# Altium schematic sheet AM437x_GP_EVM_PMconnect.SchDoc
size A
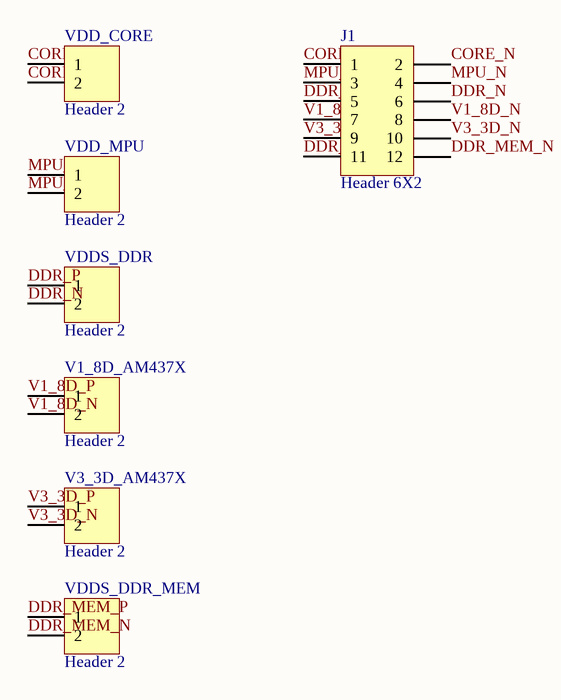
[diagram p0: AM437x_GP_EVM_PMconnect.SchDoc]

## Parts
J1  Header 6X2  [HDR2X6]
V1_8D_AM437X  Header 2  [HDR1X2]
V3_3D_AM437X  Header 2  [HDR1X2]
VDD_CORE  Header 2  [HDR1X2]
VDD_MPU  Header 2  [HDR1X2]
VDDS_DDR  Header 2  [HDR1X2]
VDDS_DDR_MEM  Header 2  [HDR1X2]

## Nets
CORE_N: J1.2 VDD_CORE.2
CORE_P: J1.1 VDD_CORE.1
DDR_MEM_N: J1.12 VDDS_DDR_MEM.2
DDR_MEM_P: J1.11 VDDS_DDR_MEM.1
DDR_N: J1.6 VDDS_DDR.2
DDR_P: J1.5 VDDS_DDR.1
MPU_N: J1.4 VDD_MPU.2
MPU_P: J1.3 VDD_MPU.1
V1_8D_N: J1.8 V1_8D_AM437X.2
V1_8D_P: J1.7 V1_8D_AM437X.1
V3_3D_N: J1.10 V3_3D_AM437X.2
V3_3D_P: J1.9 V3_3D_AM437X.1

## Library data of the parts
J1 = Header 6X2: Header, 6-Pin, Dual row; LatestRevisionDate: 17-Jul-2002; LatestRevisionNote: Re-released for DXP Platform.; Publisher: Altium Limited
V1_8D_AM437X V3_3D_AM437X VDD_CORE VDD_MPU VDDS_DDR VDDS_DDR_MEM = Header 2: Header, 2-Pin; LatestRevisionDate: 17-Jul-2002; LatestRevisionNote: Re-released for DXP Platform.; Publisher: Altium Limited